# Altium schematic sheet dev1.SchDoc
size A1
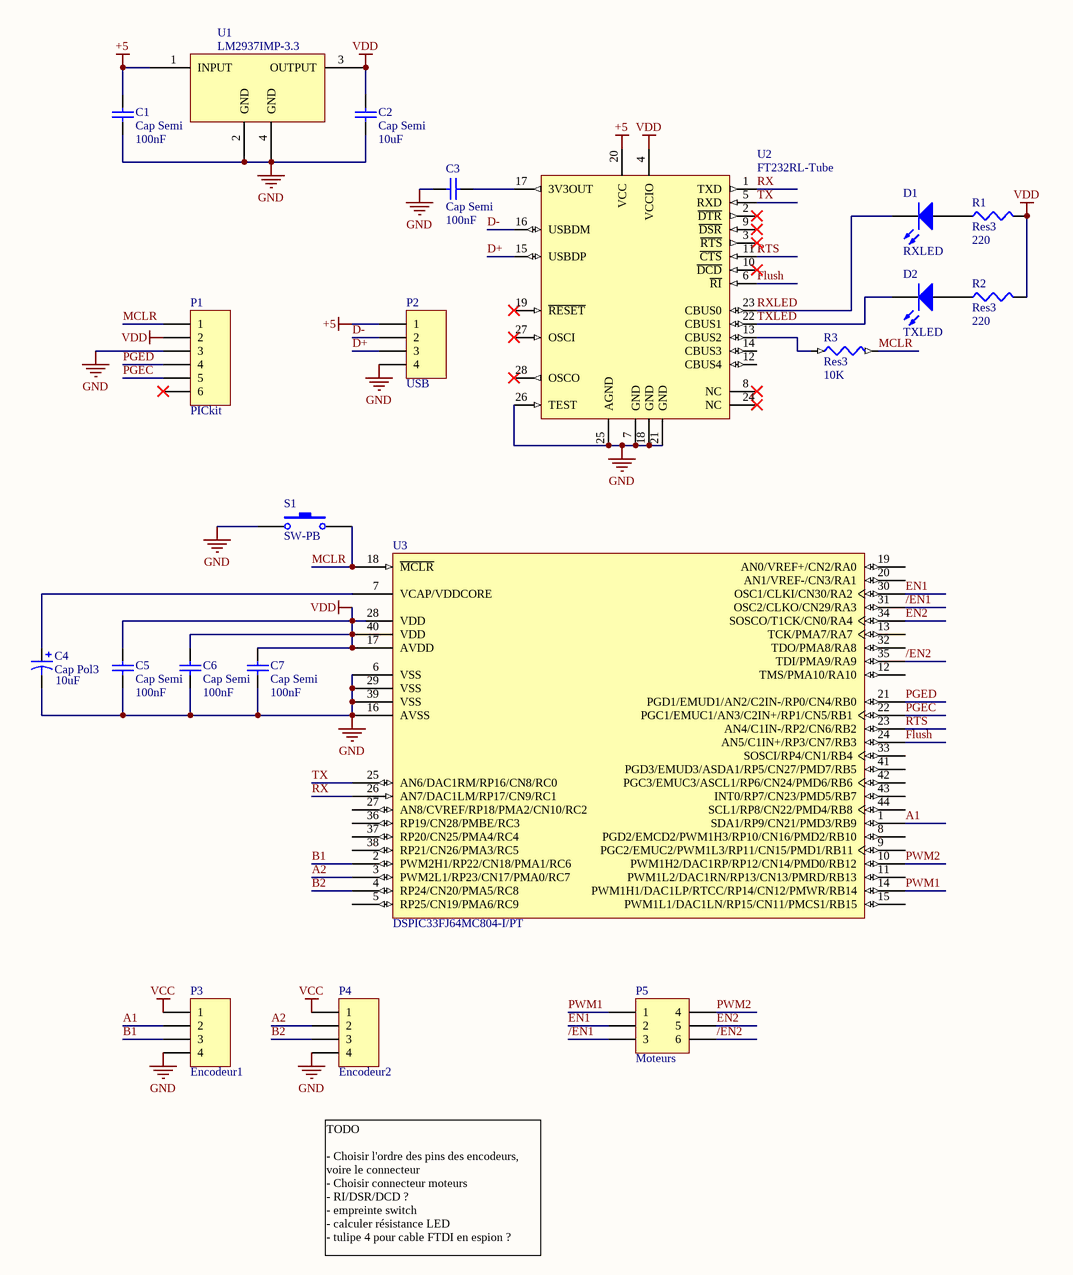
[diagram p0: dev1.SchDoc]

## Parts
C1  Cap Semi  value 100nF  [C1206]
C2  Cap Semi  value 10uF  [C1206]
C3  Cap Semi  value 100nF  [C1206]
C4  Cap Pol3  value 10uF  [C0805]
C5  Cap Semi  value 100nF  [C1206]
C6  Cap Semi  value 100nF  [C1206]
C7  Cap Semi  value 100nF  [C1206]
D1  RXLED  [3.2X1.6X1.1]
D2  TXLED  [3.2X1.6X1.1]
P1  PICkit  [HDR1X6H]
P2  USB  [HDR1X4]
P3  Encodeur1  [HDR1X4]
P4  Encodeur2  [HDR1X4]
P5  Moteurs  [HDR2X3_CEN]
R1  Res3  value 220  [J1-0603]
R2  Res3  value 220  [J1-0603]
R3  Res3  value 10K  [J1-0603]
S1  SW-PB  [SPST-2]
U1  LM2937IMP-3.3
U2  FT232RL-Tube  [SSOP-28_N]
U3  DSPIC33FJ64MC804-I/PT  [TQFP-PT44_N]

## Nets
+5: C1.1 P2.1 U1.1(INPUT) U2.20(VCC)
GND: C1.2 C2.2 C3.1 C4.2 C5.2 C6.2 C7.2 P1.3 P2.4 P3.4 P4.4 S1.1 U1.2(GND) U1.4(GND) U2.7(GND) U2.18(GND) U2.21(GND) U2.25(AGND) U2.26(TEST) U3.6(VSS) U3.16(AVSS) U3.29(VSS) U3.39(VSS)
VCC: P3.1 P4.1
VDD: C2.1 C5.1 C6.1 C7.1 P1.2 R1.2 R2.2 U1.3(OUTPUT) U2.4(VCCIO) U3.17(AVDD) U3.28(VDD) U3.40(VDD)
/EN1: P5.3 U3.31(OSC2/CLKO/CN29/RA3)
/EN2: P5.6 U3.35(TDI/PMA9/RA9)
A1: P3.2 U3.1(SDA1/RP9/CN21/PMD3/RB9)
A2: P4.2 U3.3(PWM2L1/RP23/CN17/PMA0/RC7)
B1: P3.3 U3.2(PWM2H1/RP22/CN18/PMA1/RC6)
B2: P4.3 U3.4(RP24/CN20/PMA5/RC8)
D+: P2.3 U2.15(USBDP)
D-: P2.2 U2.16(USBDM)
EN1: P5.2 U3.30(OSC1/CLKI/CN30/RA2)
EN2: P5.5 U3.34(SOSCO/T1CK/CN0/RA4)
Flush: U2.6(~{RI}) U3.24(AN5/C1IN+/RP3/CN7/RB3)
MCLR: P1.1 R3.2 S1.2 U3.18(~{MCLR})
PGEC: P1.5 U3.22(PGC1/EMUC1/AN3/C2IN+/RP1/CN5/RB1)
PGED: P1.4 U3.21(PGD1/EMUD1/AN2/C2IN-/RP0/CN4/RB0)
PWM1: P5.1 U3.14(PWM1H1/DAC1LP/RTCC/RP14/CN12/PMWR/RB14)
PWM2: P5.4 U3.10(PWM1H2/DAC1RP/RP12/CN14/PMD0/RB12)
RTS: U2.11(~{CTS}) U3.23(AN4/C1IN-/RP2/CN6/RB2)
RX: U2.1(TXD) U3.26(AN7/DAC1LM/RP17/CN9/RC1)
RXLED: D1.2(K) U2.23(CBUS0)
TX: U2.5(RXD) U3.25(AN6/DAC1RM/RP16/CN8/RC0)
TXLED: D2.2(K) U2.22(CBUS1)
NetC3_2: C3.2 U2.17(3V3OUT)
NetC4_1: C4.1 U3.7(VCAP/VDDCORE)
NetD1_1: D1.1(A) R1.1
NetD2_1: D2.1(A) R2.1
NetR3_1: R3.1 U2.13(CBUS2)

Not connected (* = marked no-connect by the designer): P1 6*; U2 2(~{DTR})* 3(~{RTS})* 8(NC)* 9(~{DSR})* 10(~{DCD})* 12(CBUS4) 14(CBUS3) 19(~{RESET})* 24(NC)* 27(OSCI)* 28(OSCO)*; U3 5(RP25/CN19/PMA6/RC9) 8(PGD2/EMCD2/PWM1H3/RP10/CN16/PMD2/RB10) 9(PGC2/EMUC2/PWM1L3/RP11/CN15/PMD1/RB11) 11(PWM1L2/DAC1RN/RP13/CN13/PMRD/RB13) 12(TMS/PMA10/RA10) 13(TCK/PMA7/RA7) 15(PWM1L1/DAC1LN/RP15/CN11/PMCS1/RB15) 19(AN0/VREF+/CN2/RA0) 20(AN1/VREF-/CN3/RA1) 27(AN8/CVREF/RP18/PMA2/CN10/RC2) 32(TDO/PMA8/RA8) 33(SOSCI/RP4/CN1/RB4) 36(RP19/CN28/PMBE/RC3) 37(RP20/CN25/PMA4/RC4) 38(RP21/CN26/PMA3/RC5) 41(PGD3/EMUD3/ASDA1/RP5/CN27/PMD7/RB5) 42(PGC3/EMUC3/ASCL1/RP6/CN24/PMD6/RB6) 43(INT0/RP7/CN23/PMD5/RB7) 44(SCL1/RP8/CN22/PMD4/RB8)

## Notes on the sheet
- TODO
  - Choisir l'ordre des pins des encodeurs, voire le connecteur
  - Choisir connecteur moteurs
  - RI/DSR/DCD ?
  - empreinte switch
  - calculer résistance LED
  - tulipe 4 pour cable FTDI en espion ?

## Library data of the parts
C1-C3 C5-C7 = Cap Semi: Capacitor (Semiconductor SIM Model); Published: 8-Jun-2000; LatestRevisionDate: 29-May-2009; LatestRevisionNote: IPC-7351 Footprint Added.; PackageReference: C1206; Publisher: Altium Limited; PackageDescription: Chip Capacitor
C4 = Cap Pol3: Polarized Capacitor (Surface Mount); Published: 8-Jun-2000; LatestRevisionDate: 29-May-2009; LatestRevisionNote: IPC-7351 Footprint Added.; PackageReference: C0805; Publisher: Altium Limited; PackageDescription: Chip Capacitor
D1 D2 = LED2: Typical RED, GREEN, YELLOW, AMBER GaAs LED; Published: 8-Jun-2000; LatestRevisionDate: 17-Jul-2002; LatestRevisionNote: Re-released for DXP Platform.; PackageVersion: Feb-2002; PackageReference: 3.2X1.6X1.1; Publisher: Altium Limited; PackageDescription: SM LED; 2 Flat Leads
P1 = Header 6H: Header, 6-Pin, Right Angle; LatestRevisionDate: 17-Jul-2002; LatestRevisionNote: Re-released for DXP Platform.; Publisher: Altium Limited
P2-P4 = Header 4: Header, 4-Pin; LatestRevisionDate: 17-Jul-2002; LatestRevisionNote: Re-released for DXP Platform.; Publisher: Altium Limited
P5 = Header 3X2A: Header, 3-Pin, Dual row; LatestRevisionDate: 17-Jul-2002; LatestRevisionNote: Re-released for DXP Platform.; Publisher: Altium Limited
R1-R3 = Res3: Resistor; Published: 8-Jun-2000; LatestRevisionDate: 29-May-2009; LatestRevisionNote: IPC-7351 Footprint Added.; PackageReference: J1-0603; Publisher: Altium Limited; PackageDescription: Chip Resistor
S1 = SW-PB: Switch; Published: 24-Mar-1999; LatestRevisionDate: 17-Jul-2002; LatestRevisionNote: Re-released for DXP Platform.; PackageReference: SPST-2; Publisher: Altium Limited; PackageDescription: Switch; 2 Leads
U1 = LM2937IMP-3.3: 500 mA Low Dropout Regulator
U2 = FT232RL-Tube: USB UART Asynchronous Serial Data Transfer Chip, SSOP-28, Tube; Published: 19-Aug-2010; DatasheetVersion: ver 2.07, Jul-2010; PackageVersion: 2010; PackageReference: SSOP-28; Publisher: Altium Limited; PackageDescription: 28-Pin Small Outline Package 0.65 mm Pitch; ComponentLink1Description: Manufacturer Link; ComponentLink1URL: http://www.ftdichip.com/Products/ICs/FT232R.htm; ComponentLink2Description: Datasheet; ComponentLink2URL: http://www.ftdichip.com/Support/Documents/DataSheets/ICs/DS_FT232R.pdf
U3 = DSPIC33FJ64MC804-I/PT: High-Performance 16-bit Digital Signal Controller, 64 KB Flash, 16 KB RAM, 44-Pin TQFP, Industrial Temperature; Published: 2-Dec-2009; DatasheetVersion: revD, Nov-2009; PackageVersion: revBB, Aug-2009; PackageReference: TQFP-PT44; Publisher: Altium Limited; PackageDescription: 44-Lead Plastic Thin Quad Flatpack (PT) - 10x10x1mm Body, 2.00mm [TQFP]; Supplier 1: Digi-Key; Supplier Part Number 1: DSPIC33FJ64MC804-I/PT-ND; Supplier 2: Farnell; Supplier Part Number 2: 1576844; Code_JEDEC: MS-026; ComponentLink1Description: Datasheet; ComponentLink1URL: http://ww1.microchip.com/downloads/en/DeviceDoc/70291D.pdf; ComponentLink2Description: Packaging Specification; ComponentLink2URL: http://www.microchip.com/stellent/groups/techpub_sg/documents/packagingspec/en012702.pdf; ComponentLink3Description: Microchip.com Home; ComponentLink3URL: http://www.microchip.com/